# Altium schematic sheet 传感器.SchDoc
size A3
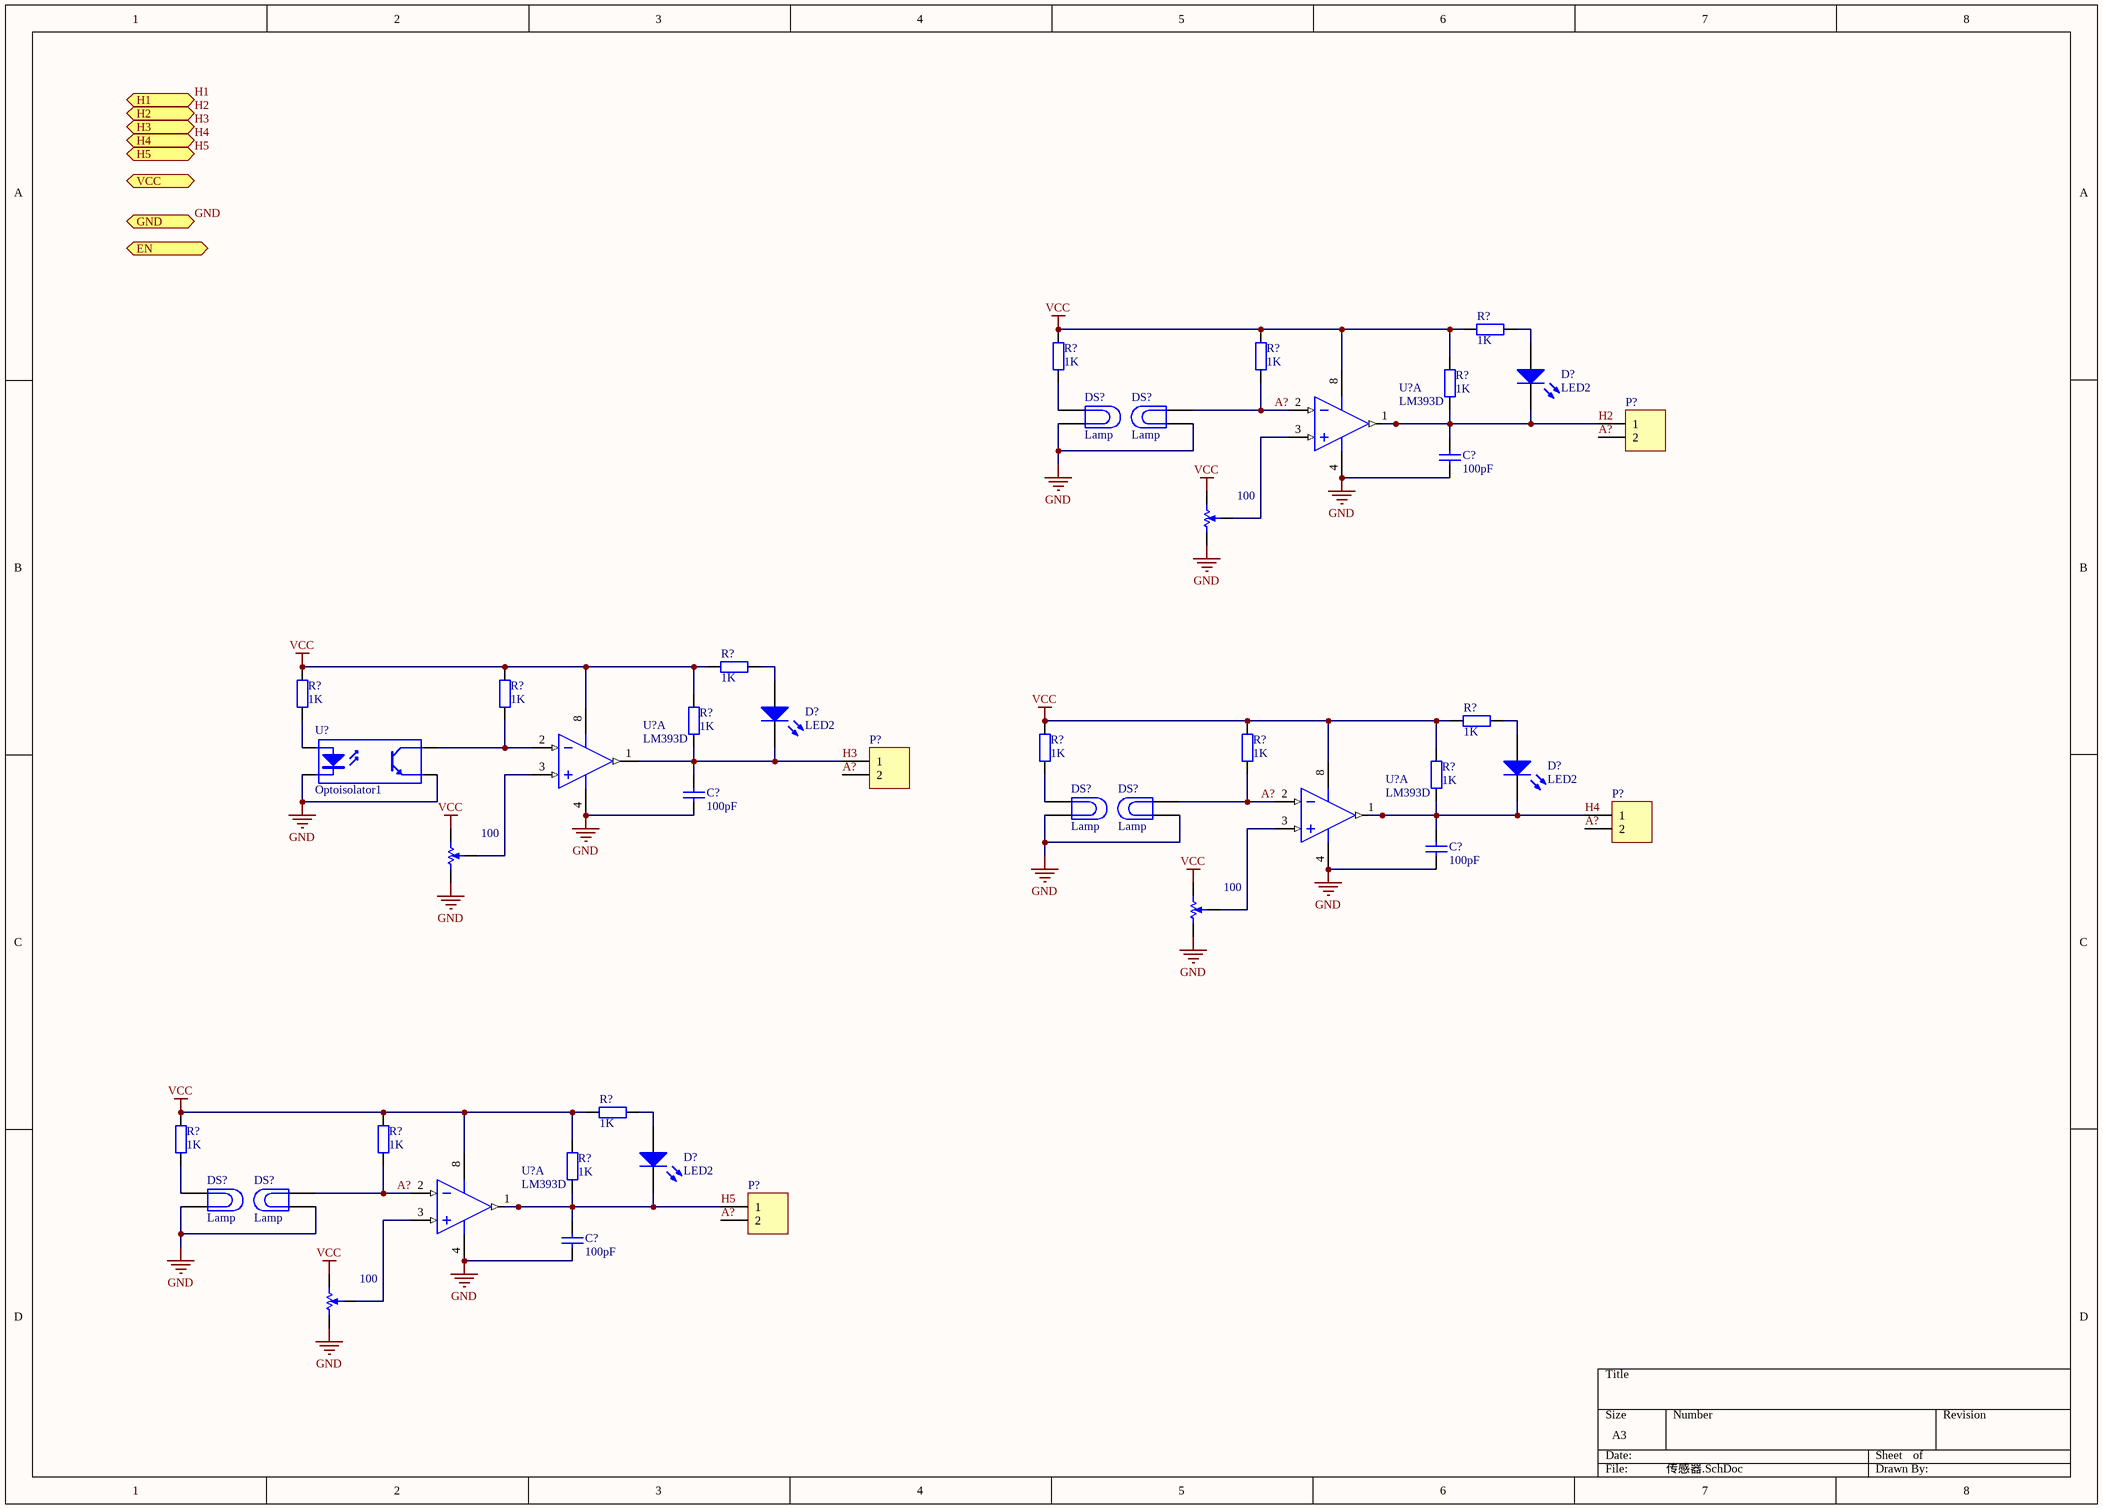
[diagram p0: 传感器.SchDoc]

## Parts
(Parts that share a designator on the sheet are numbered #1, #2 ... from top to bottom, then left to right.)
100#1  RPot SM  [POT4MM-2]  (value not drawn)
100#2  RPot SM  [POT4MM-2]  (value not drawn)
100#3  RPot SM  [POT4MM-2]  (value not drawn)
100#4  RPot SM  [POT4MM-2]  (value not drawn)
C?#1  value 100pF  [6-0805_N]  (hidden comment: Cap)
C?#2  value 100pF  [6-0805_N]  (hidden comment: Cap)
C?#3  value 100pF  [6-0805_N]  (hidden comment: Cap)
C?#4  value 100pF  [6-0805_N]  (hidden comment: Cap)
D?#1  LED2  [3.2X1.6X1.1]
D?#2  LED2  [3.2X1.6X1.1]
D?#3  LED2  [3.2X1.6X1.1]
D?#4  LED2  [3.2X1.6X1.1]
DS?#1  Lamp  [PIN2]
DS?#2  Lamp  [PIN2]
DS?#3  Lamp  [PIN2]
DS?#4  Lamp  [PIN2]
DS?#5  Lamp  [PIN2]
DS?#6  Lamp  [PIN2]
P?#1  (no value)  [HDR1X2]
P?#2  (no value)  [HDR1X2]
P?#3  (no value)  [HDR1X2]
P?#4  (no value)  [HDR1X2]
R?#1  value 1K  [6-0805_N]  (hidden comment: Res2)
R?#2  value 1K  [6-0805_N]  (hidden comment: Res2)
R?#3  value 1K  [6-0805_N]  (hidden comment: Res2)
R?#4  value 1K  [6-0805_N]  (hidden comment: Res2)
R?#5  value 1K  [6-0805_N]  (hidden comment: Res2)
R?#6  value 1K  [6-0805_N]  (hidden comment: Res2)
R?#7  value 1K  [6-0805_N]  (hidden comment: Res2)
R?#8  value 1K  [6-0805_N]  (hidden comment: Res2)
R?#9  value 1K  [6-0805_N]  (hidden comment: Res2)
R?#10  value 1K  [6-0805_N]  (hidden comment: Res2)
R?#11  value 1K  [6-0805_N]  (hidden comment: Res2)
R?#12  value 1K  [6-0805_N]  (hidden comment: Res2)
R?#13  value 1K  [6-0805_N]  (hidden comment: Res2)
R?#14  value 1K  [6-0805_N]  (hidden comment: Res2)
R?#15  value 1K  [6-0805_N]  (hidden comment: Res2)
R?#16  value 1K  [6-0805_N]  (hidden comment: Res2)
U?#1  LM393D  [751-02_N]  (part A of 2)
U?#2  Optoisolator1  [DIP-4]
U?#3  LM393D  [751-02_N]  (part A of 2)
U?#4  LM393D  [751-02_N]  (part A of 2)
U?#5  LM393D  [751-02_N]  (part A of 2)

## Ports
EN (in), GND, H1 (out), H2 (out), H3 (out), H4 (out), H5 (out), VCC (in)

## Nets
GND: 100#1.CCW(-) 100#2.CCW(-) 100#3.CCW(-) 100#4.CCW(-) C?#1.1 C?#2.1 C?#3.1 C?#4.1 DS?#1.2 DS?#2.1 DS?#3.2 DS?#4.1 DS?#5.2 DS?#6.1 U?#1.4(GND) U?#2.2(K) U?#2.3(E) U?#3.4(GND) U?#4.4(GND) U?#5.4(GND) ; port GND
VCC: 100#1.CW(+) 100#2.CW(+) 100#3.CW(+) 100#4.CW(+) R?#1.1 R?#2.2 R?#3.2 R?#4.2 R?#5.1 R?#6.2 R?#7.2 R?#8.1 R?#9.2 R?#10.2 R?#11.2 R?#12.2 R?#13.1 R?#14.2 R?#15.2 R?#16.2 U?#1.8(V+) U?#3.8(V+) U?#4.8(V+) U?#5.8(V+)
A?: DS?#2.2 DS?#4.2 DS?#6.2 P?#1.2 P?#2.2 P?#3.2 P?#4.2 R?#3.1 R?#11.1 R?#15.1 U?#1.2(IN-) U?#4.2(IN-) U?#5.2(IN-)
H1: port H1
H2: C?#1.2 D?#1.2(K) P?#1.1 R?#4.1 U?#1.1(OUT) ; port H2
H3: C?#2.2 D?#2.2(K) P?#2.1 R?#9.1 U?#3.1(OUT) ; port H3
H4: C?#3.2 D?#3.2(K) P?#3.1 R?#12.1 U?#4.1(OUT) ; port H4
H5: C?#4.2 D?#4.2(K) P?#4.1 R?#16.1 U?#5.1(OUT) ; port H5
Net100#1_W: 100#1.W U?#1.3(IN+)
Net100#2_W: 100#2.W U?#3.3(IN+)
Net100#3_W: 100#3.W U?#4.3(IN+)
Net100#4_W: 100#4.W U?#5.3(IN+)
NetD?#1_1: D?#1.1(A) R?#1.2
NetD?#2_1: D?#2.1(A) R?#5.2
NetD?#3_1: D?#3.1(A) R?#8.2
NetD?#4_1: D?#4.1(A) R?#13.2
NetDS?#1_1: DS?#1.1 R?#2.1
NetDS?#3_1: DS?#3.1 R?#10.1
NetDS?#5_1: DS?#5.1 R?#14.1
NetR?#6_1: R?#6.1 U?#2.1(A)
NetR?#7_1: R?#7.1 U?#2.4(C) U?#3.2(IN-)

## Library data of the parts
100#1-100#4 = RPot SM: Square Trimming Potentiometer; Published: 17-Dec-2003; DatasheetVersion: Oct-2003; PackageReference: POT4MM-2; Publisher: Altium Limited; PackageDescription: Square Trimming Potentiometer; ComponentLink1Description: Manufacturer Link; ComponentLink1URL: http://bourns.com/2/search.html
C?#1-C?#4 = Cap: Capacitor; Published: 8-Jun-2000; LatestRevisionDate: 17-Jul-2002; LatestRevisionNote: Re-released for DXP Platform.; PackageReference: RAD-0.3; Publisher: Altium Limited; PackageDescription: Radial Cap, Thru-Hole; 2 Leads; 0.3 in Pin Spacing
D?#1-D?#4 = LED2: Typical RED, GREEN, YELLOW, AMBER GaAs LED; Published: 8-Jun-2000; LatestRevisionDate: 17-Jul-2002; LatestRevisionNote: Re-released for DXP Platform.; PackageVersion: Feb-2002; PackageReference: 3.2X1.6X1.1; Publisher: Altium Limited; PackageDescription: SM LED; 2 Flat Leads
DS?#1-DS?#6 = Lamp: Incandescent Bulb; Published: 24-Mar-1999; LatestRevisionDate: 17-Jul-2002; LatestRevisionNote: Re-released for DXP Platform.; PackageReference: PIN2; Publisher: Altium Limited
P?#1-P?#4 = Header 2: Header, 2-Pin; LatestRevisionDate: 17-Jul-2002; LatestRevisionNote: Re-released for DXP Platform.; Publisher: Altium Limited
R?#1-R?#16 = Res2: Resistor; Published: 8-Jun-2000; LatestRevisionDate: 17-Jul-2002; LatestRevisionNote: Re-released for DXP Platform.; PackageReference: AXIAL-0.4; Publisher: Altium Limited; PackageDescription: Axial Device, Thru-Hole; 2 Leads; 0.4 in Pin Spacing
U?#1 U?#3-U?#5 = LM393D: Dual Comparator; Published: 17-Jul-2002; LatestRevisionDate: 13-Apr-2006; LatestRevisionNote: IPC-7351 Footprint Added.; DatasheetVersion: 1988; PackageReference: 751-02; Publisher: Altium Limited; PackageDescription: 8-Pin Small Outline Integrated Circuit 1.27 mm Pitch; Code_JEDEC: MS-012-AA; Code_IPC: SOIC127P600-8; ComponentLink1Description: Manufacturer Link; ComponentLink1URL: http://www.onsemi.com/site/products/taxonomy/0,4438,133,00.html
U?#2 = Optoisolator1: 4-Pin Phototransistor Optocoupler; Published: 24-Mar-1999; LatestRevisionDate: 04-Mar-2005; LatestRevisionNote: Sch pins 3 & 4 Swapped.; DatasheetVersion: Nov-2003; PackageReference: DIP-4; Publisher: Altium Limited